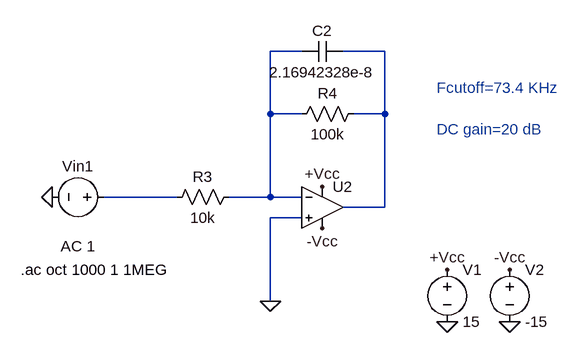
[diagram p0: schematic 2017AAPS1734H_Run2.asc]
2017AAPS1734H_Run2.asc, the LTspice schematic file:
Version 4
SHEET 1 880 680
WIRE 112 -576 64 -576
WIRE 240 -576 176 -576
WIRE 64 -480 64 -576
WIRE 112 -480 64 -480
WIRE 240 -480 240 -576
WIRE 240 -480 192 -480
WIRE -80 -352 -192 -352
WIRE 64 -352 64 -480
WIRE 64 -352 0 -352
WIRE 112 -352 64 -352
WIRE 240 -336 240 -480
WIRE 240 -336 176 -336
WIRE 112 -320 64 -320
WIRE 64 -192 64 -320
FLAG 336 -160 0
FLAG 432 -160 0
FLAG 336 -240 +Vcc
FLAG 432 -240 -Vcc
FLAG 144 -304 -Vcc
FLAG 144 -368 +Vcc
FLAG -272 -352 0
FLAG 64 -192 0
SYMBOL Opamps\\UniversalOpamp2 144 -336 R0
SYMATTR InstName U2
SYMBOL voltage 336 -256 R0
WINDOW 123 0 0 Left 0
WINDOW 39 24 124 Left 2
SYMATTR InstName V1
SYMATTR Value 15
SYMBOL voltage 432 -256 R0
SYMATTR InstName V2
SYMATTR Value -15
SYMBOL res 16 -368 R90
WINDOW 0 0 56 VBottom 2
WINDOW 3 32 56 VTop 2
SYMATTR InstName R3
SYMATTR Value 10k
SYMBOL res 208 -496 R90
WINDOW 0 0 56 VBottom 2
WINDOW 3 32 56 VTop 2
SYMATTR InstName R4
SYMATTR Value 100k
SYMBOL voltage -176 -352 R90
WINDOW 0 -32 56 VBottom 2
WINDOW 3 88 56 VTop 2
WINDOW 123 60 56 VTop 2
WINDOW 39 0 0 Left 0
SYMATTR InstName Vin1
SYMATTR Value ""
SYMATTR Value2 AC 1
SYMBOL cap 176 -592 R90
WINDOW 0 0 32 VBottom 2
WINDOW 3 32 32 VTop 2
SYMATTR InstName C2
SYMATTR Value 2.16942328e-8
TEXT -320 -240 Left 2 !.ac oct 1000 1 1MEG
TEXT 320 -520 Left 2 ;Fcutoff=73.4 KHz
TEXT 320 -456 Left 2 ;DC gain=20 dB

The netlist it stands for:
* 2017AAPS1734H_Run2.asc
XU2 0 N001 +Vcc -Vcc N002 level.2 Avol=1Meg GBW=10Meg Slew=10Meg ilimit=25m rail=0 Vos=0 phimargin=45 en=0 enk=0 in=0 ink=0 Rin=500Meg  ; pins IN+ IN- V+ V- OUT
V1 +Vcc 0 15
V2 -Vcc 0 -15
R3 N001 N003 10k
R4 N002 N001 100k
Vin1 N003 0 AC 1
C2 N002 N001 2.16942328e-8
.ac oct 1000 1 1MEG
* Fcutoff=73.4 KHz
* DC gain=20 dB
.lib UniversalOpamps2.sub
.backanno
.end